# EasyEDA Pro project ProPrj_SaveMyBook_2026-05-25.epro

# Schematic Schematic1
Board Name: Board1; Create Date: 2026-05-07; Page Name: P1; Project Name: SaveMyBook; Schematic Name: Schematic1; Update Date: 2026-05-07
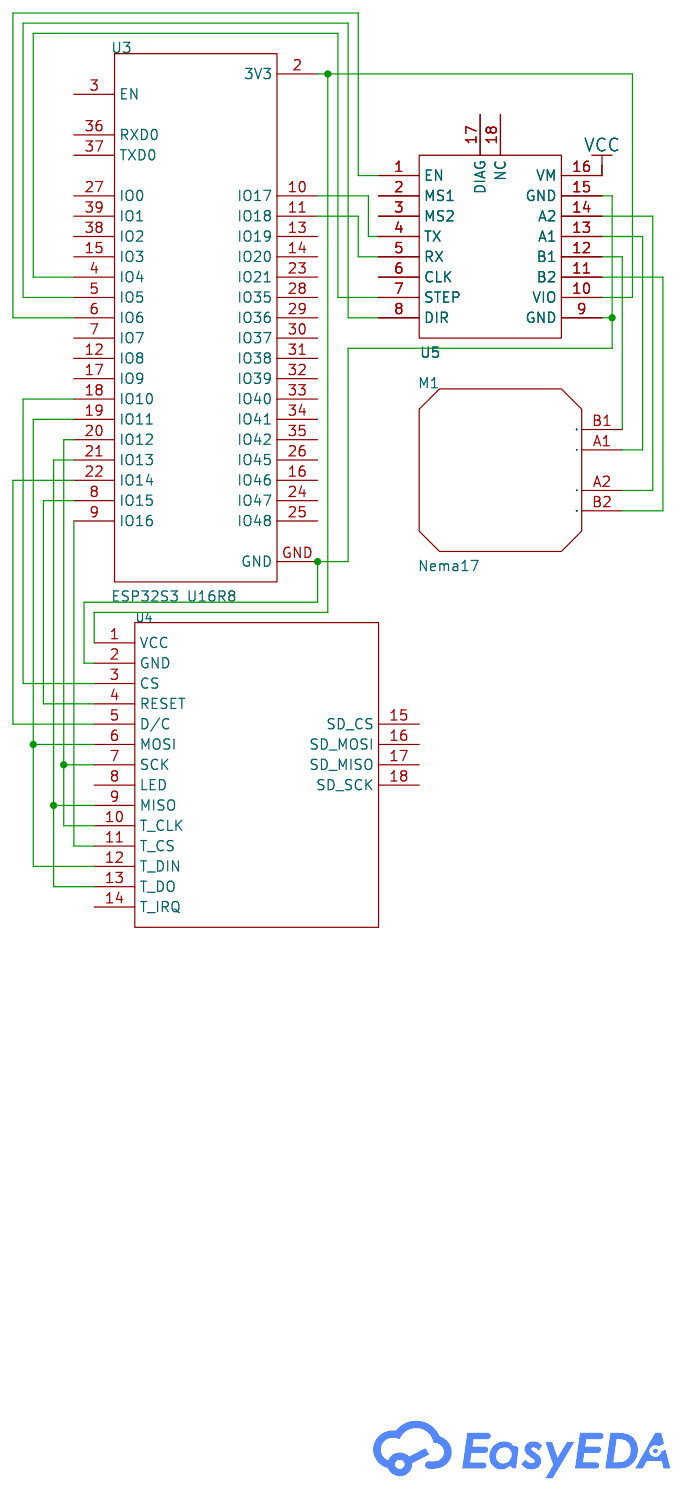
[diagram p0: schematic sheet]

## Parts
M1  Nema17  [Nema Connector]
U3  ESP32S3 U16R8  [ESP32S3]
U4  -
U5  -  [TMC2209]

## Library data of the parts
M1 = Nema17
U3 = ESP32S3
U4 = LCD-TJCTM24028-SPI-2.8-inch: link: http://www.ebay.co.uk/itm/351337012012?_trksid=p2060353.m2749.l2649&amp;ssPageName=STRK%3AMEBIDX%3AIT
U5 = TMC2209: _: 3

## Nets
VCC: U5.16(VM)
Net-(M1-A1): M1.A1 U5.13(A1)
Net-(M1-A2): M1.A2 U5.14(A2)
Net-(M1-B1): M1.B1 U5.12(B1)
Net-(M1-B2): M1.B2 U5.11(B2)
Net-(U3-2): U3.2(3V3) U4.1(VCC) U5.10(VIO)
Net-(U3-4): U3.4(IO4) U5.7(STEP)
Net-(U3-5): U3.5(IO5) U5.8(DIR)
Net-(U3-6): U3.6(IO6) U5.1(EN)
Net-(U3-8): U3.8(IO15) U4.4(RESET)
Net-(U3-9): U3.9(IO16) U4.11(T_CS)
Net-(U3-10): U3.10(IO17) U5.4(TX)
Net-(U3-11): U3.11(IO18) U5.5(RX)
Net-(U3-18): U3.18(IO10) U4.3(CS)
Net-(U3-19): U3.19(IO11) U4.6(MOSI) U4.12(T_DIN)
Net-(U3-20): U3.20(IO12) U4.7(SCK) U4.10(T_CLK)
Net-(U3-21): U3.21(IO13) U4.9(MISO) U4.13(T_DO)
Net-(U3-22): U3.22(IO14) U4.5(D/C)
Net-(U3-GND): U3.GND U4.2(GND) U5.9(GND) U5.15(GND)

Not connected (* = marked no-connect by the designer): U3 3(EN) 7(IO7) 12(IO8) 13(IO19) 14(IO20) 15(IO3) 16(IO46) 17(IO9) 23(IO21) 24(IO47) 25(IO48) 26(IO45) 27(IO0) 28(IO35) 29(IO36) 30(IO37) 31(IO38) 32(IO39) 33(IO40) 34(IO41) 35(IO42) 36(RXD0) 37(TXD0) 38(IO2) 39(IO1); U4 8(LED) 14(T_IRQ) 15(SD_CS) 16(SD_MOSI) 17(SD_MISO) 18(SD_SCK); U5 2(MS1) 3(MS2) 6(CLK) 17(DIAG) 18(NC)
